# EAGLE design BB (EAGLE 6.5.0)
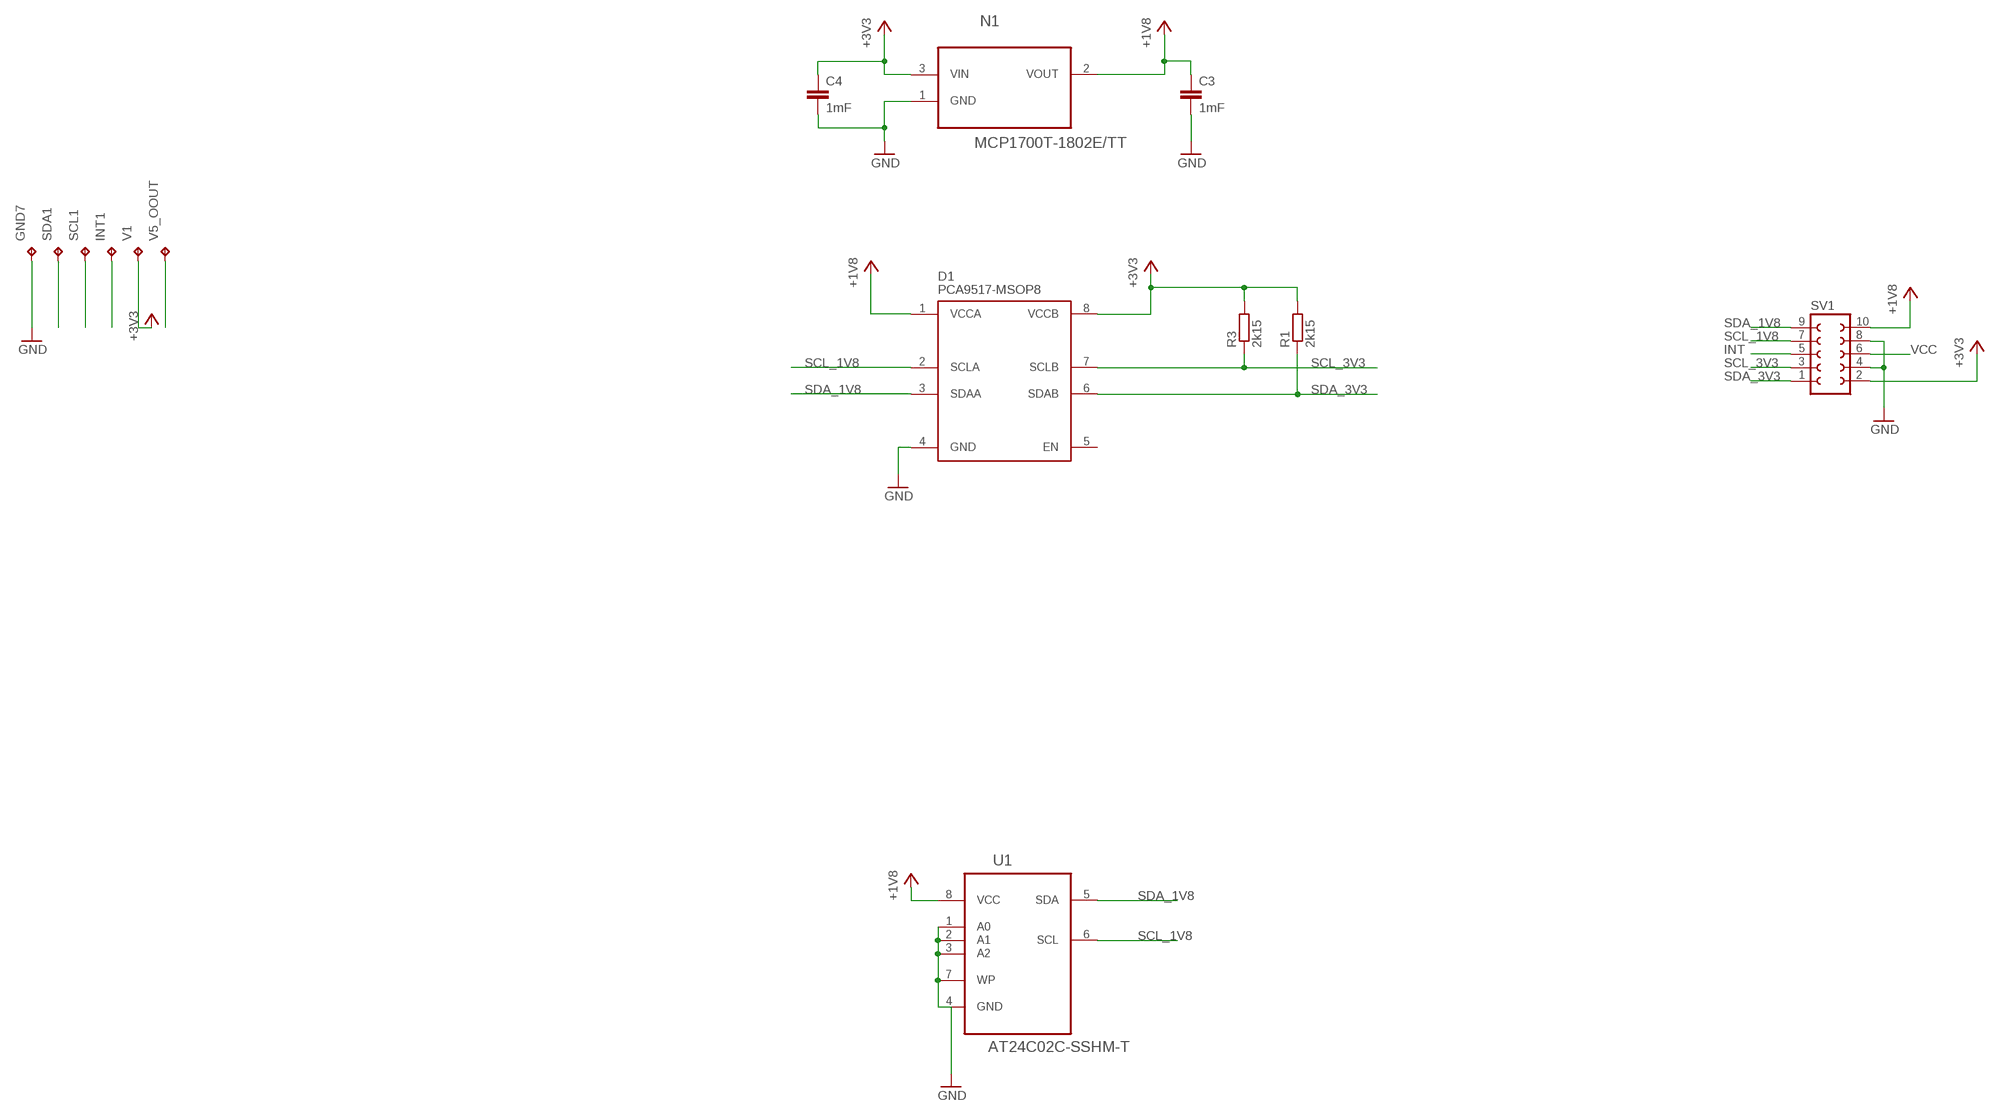
[diagram p0: schematic, sheet 1]

## Parts
C3  1mF  C-EUC1206  [C1206]
C4  1mF  C-EUC1206  [C1206]
D1  PCA9517-MSOP8  PCA9517  [SOP65P490X110-8N]
GND7  TPTP20SQ  [TP20SQ]
INT1  TPTP20SQ  [TP20SQ]
N1  MCP1700T-1802E/TT  [SOT95P237X112-3N]
R1  2k15  R-EU_R1206  [R1206]
R3  2k15  R-EU_R1206  [R1206]
SCL1  TPTP20SQ  [TP20SQ]
SDA1  TPTP20SQ  [TP20SQ]
SV1  FE05-2  [FE05-2]
U1  AT24C02C-SSHM-T  [SOIC127P600X175-8N]
V1  TPTP20SQ  [TP20SQ]
V5_OOUT  TPTP20SQ  [TP20SQ]

## Nets
+1V8: C3.1 D1.1(VCCA) N1.2(VOUT) SV1.10 U1.8(VCC)
+3V3: C4.1 D1.8(VCCB) N1.3(VIN) R1.2 R3.2 SV1.2 V1.TP
GND: C3.2 C4.2 D1.4(GND) GND7.TP N1.1(GND) SV1.4 SV1.8 U1.1(A0) U1.2(A1) U1.3(A2) U1.7(WP)
INT: INT1.TP SV1.5
SCL_1V8: D1.2(SCLA) SCL1.TP SV1.7 U1.6(SCL)
SCL_3V3: D1.7(SCLB) R3.1 SV1.3
SDA_1V8: D1.3(SDAA) SDA1.TP SV1.9 U1.5(SDA)
SDA_3V3: D1.6(SDAB) R1.1 SV1.1
VCC: SV1.6 V5_OOUT.TP
Unconnected: D1.5(EN)

## Power pins joined to a net without a drawn wire
GND: U1.4(GND)

## Library data of the parts
C3 C4 = rcl:C-EU: CAPACITOR, European symbol
D1 = OMAT_IC:PCA9517
GND7 INT1 SCL1 SDA1 V1 V5_OOUT = testpad:TP: Test pad
N1 = Microchip_By_element14_Batch_1:MCP1700T-1802E/TT: Low Quiescent Current LDO; MPN: MCP1700T-1802E/TT; OC_FARNELL: 1296591; OC_NEWARK: 84R5175; PACKAGE: SOT23-3; SUPPLIER: Microchip
R1 R3 = rcl:R-EU_: RESISTOR, European symbol
SV1 = con-lsta:FE05-2: FEMALE HEADER; OC_FARNELL: unknown; OC_NEWARK: unknown
U1 = AT24C02C:AT24C02C-SSHM-T: SERIAL EEPROM IC Memory Size:2Kbit,8-SOIC; MPN: AT24C02C-SSHM-T; OC_FARNELL: 2345577; OC_NEWARK: 68T4067; PACKAGE: 8SOIC; SUPPLIER: ATMEL

## Board
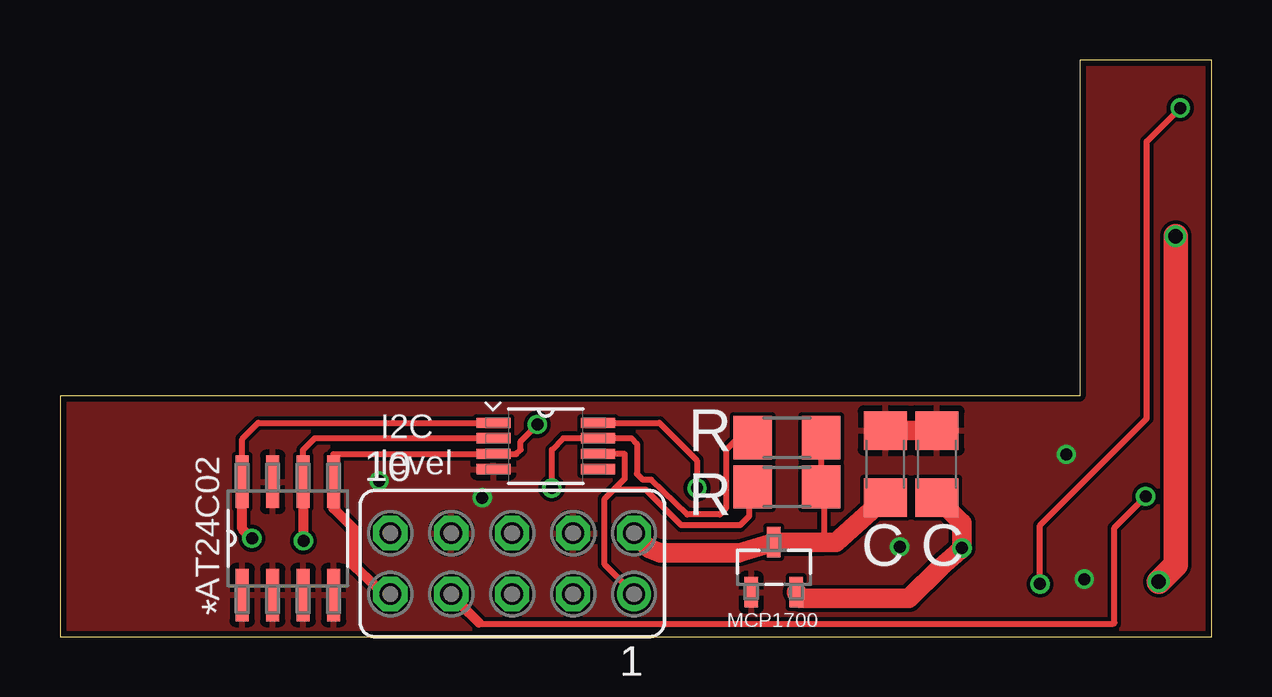
[diagram p1: board, top side]
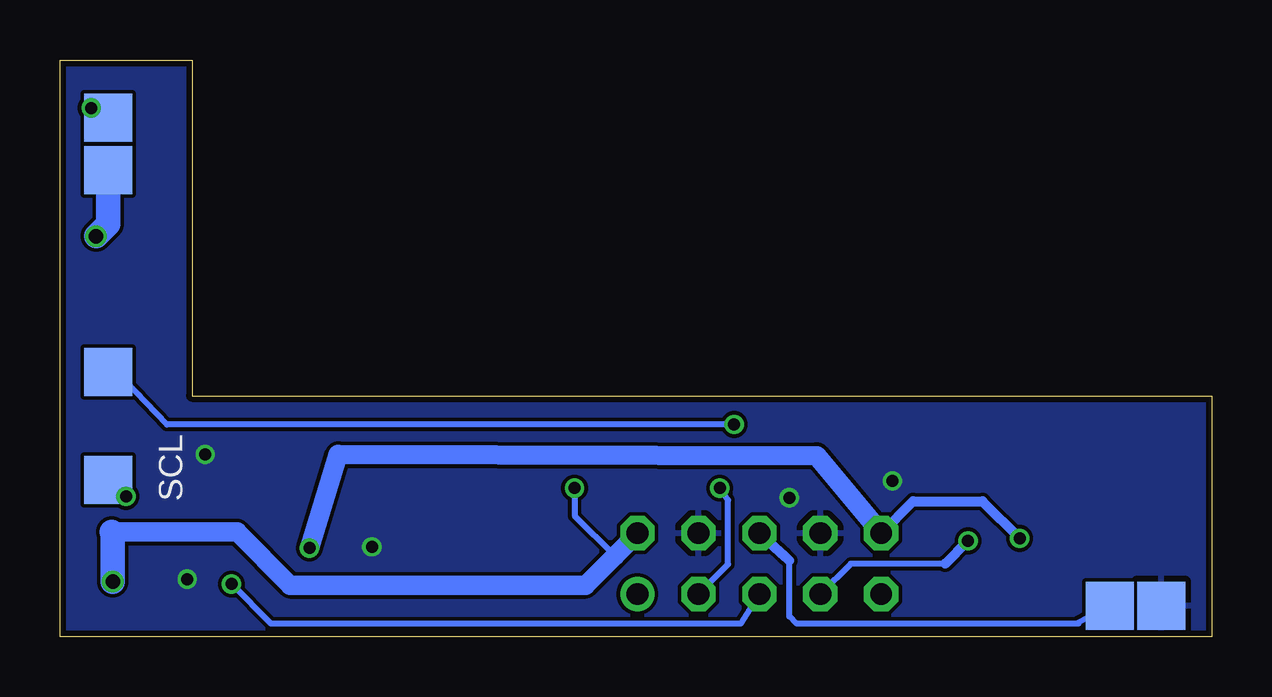
[diagram p2: board, bottom side, seen from below]

Size 48 x 24.05 mm. Coordinates in mm from the lower left corner, seen from the top.
Outline: 0,0 48,0 48,24.05 42.5,24.05 42.5,10.05 0,10.05 0,0
Copper layers (1*16): Top 0.035mm / dielectric 1.5mm / Bottom 0.035mm
Design rules "ITEADstudio_DRC": minimum track width 6mil, minimum drill 12mil, track to track 6mil, track to pad 6mil, pad to pad 6mil, via to via 6mil, smd to smd 0mil, copper to edge 10mil, drill to drill 10mil, minimum pad ring 10mil, minimum via ring 6mil, stop-mask expansion 2mil, vias tented up to drill 100mil, thermal gap 10mil

### Footprints (pad centres in the part's own frame; a part is rotated, then mirrored left to right if it is on the bottom)
C1206 = smd 1.6 x 1.8: 1 -1.4,0; 2 1.4,0
SOP65P490X110-8N = smd 1.422 x 0.432: 1 -2.184,0.965; 2 -2.184,0.33; 3 -2.184,-0.33; 4 -2.184,-0.965; 5 2.184,-0.965; 6 2.184,-0.33; 7 2.184,0.33; 8 2.184,0.965
TP20SQ = smd 2 x 2: TP 0,0
SOT95P237X112-3N = smd 0.559 x 1.27: 1 -0.94,-1.041; 2 0.94,-1.041; 3 0,1.041
R1206 = smd 1.6 x 1.803: 1 -1.422,0; 2 1.422,0
FE05-2 = drill 0.914: 1 -5.08,1.27 | drill 0.914 octagon: 2 -5.08,-1.27; 3 -2.54,1.27; 4 -2.54,-1.27; 5 0,1.27; 6 0,-1.27; 7 2.54,1.27; 8 2.54,-1.27; 9 5.08,1.27; 10 5.08,-1.27
SOIC127P600X175-8N = smd 2.184 x 0.559: 1 -2.362,1.905; 2 -2.362,0.635; 3 -2.362,-0.635; 4 -2.362,-1.905; 5 2.362,-1.905; 6 2.362,-0.635; 7 2.362,0.635; 8 2.362,1.905

### Placement (x,y rotation side)
C3  36.55,7.2 90 top
C4  34.4,7.2 90 top
D1  20.25,7.95 0 top
GND7  2.1,1.3 0 bottom
INT1  46,21.65 0 bottom
N1  29.75,2.9 0 top
R1  30.3,6.25 0 top
R3  30.3,8.3 0 top
SCL1  46,6.55 0 bottom
SDA1  46,11.05 0 bottom
SV1  18.85,3.05 180 top
U1  9.5,4.1 90 top
V1  46,19.45 0 bottom
V5_OOUT  4.25,1.3 0 bottom

### Tracks (layer width: path | path; a pad name or v marks a point on that pad's centre or on a via)
+1V8  (via drill 0.5)
  Top 0.254: U1.8 7.59,8.24 8.27,8.91 D1.1
  Top 0.406: v8,4.1 7.59,4.5 U1.8
  Top 0.813: N1.2 30.86,1.59 35.39,1.59 36.7,2.9 37.5,3.6 v37.6,3.7 37.6,4.75 C3.1
  Bottom 0.406: SV1.10 12.44,5.65 9.55,5.65 v8,4.1
  Bottom 0.813: v37.6,3.7 36.4,7.6 16.45,7.55 SV1.10
+3V3  (via drill 0.5, 0.6)
  Top 0.254: 31.85,3.93 31.85,6.12 R1.2 R3.2 | D1.8 24.98,8.91 26.55,7.35 v26.55,6.2
  Top 0.813: SV1.2 24.55,3.69 25,3.5 28.3,3.5 N1.3 31.85,3.93 31.8,3.93 32.34,3.93 C4.1
  Top 1.016: v46.5,16.7 46.5,3 v45.8,2.3
  Bottom 0.254: v26.55,6.2 26.55,5.05 24.88,3.37
  Bottom 0.813: 45.85,4.37 40.62,4.37 38.4,2.15 26.1,2.15 24.88,3.37 SV1.2
  Bottom 1.016: V1.TP 46,17.2 v46.5,16.7 | v45.8,2.3 45.8,4.32 45.85,4.37
GND  (via drill 0.5)
  Top 0.813: C4.2 C3.2
  other vias: 41.95,7.6 17.6,5.8 13.3,6.5 35,3.75 42.7,2.4
  pour Bottom: 0,10.62 41.7,21.95 41.7,24.12 48,24.12 48,0 0,0
  pour Top: 40.3,10.22 42.5,10.12 42,24.05 48,24.12 48,-0.45 arc-3 0,-0.95 0,10.15
INT  (via drill 0.5)
  Top 0.254: v40.85,2.2 40.85,4.65 45.3,9.1 45.3,20.65 v46.7,22.05
  Bottom 0.254: SV1.5 19.63,0.55 39.2,0.55 v40.85,2.2 | v46.7,22.05 45.3,22.05
  Bottom 0.406: INT1.TP 45.3,22.1 45.3,22.05
SCL_1V8  (via drill 0.5)
  Top 0.254: U1.6 10.13,7.78 10.63,8.28 D1.2 | 17.45,0.6 17.5,0.55 43.9,0.55 arc90 43.95,0.6 43.95,4.55 v45.25,5.85
  Top 0.406: v10.15,4 10.15,6.44 U1.6 | SV1.7 17.06,0.99 17.45,0.6
  Bottom 0.254: 11.1,3.05 15.04,3.05 SV1.7
  Bottom 0.406: v45.25,5.85 45.25,7.26 46,7.26 SCL1.TP | 11.1,3.05 v10.15,4
SCL_3V3  (via drill 0.5)
  Top 0.254: v20.5,6.2 20.5,7.8 20.98,8.28 D1.7 23.82,8.28 24.05,8.05 24.05,6.8 24.3,6.55 24.65,6.55 26.15,5.1 27.5,5.1 27.75,5.35 27.75,7.8 28.25,8.3 R3.1 28.86,8.28
  Bottom 0.254: SV1.3 20.15,3.02 20.15,5.7 v20.5,6.2
SDA_1V8  (via drill 0.5)
  Top 0.254: U1.5 11.4,7.62 D1.3 19.02,7.62 19.2,7.8 19.2,8.15 v19.9,8.85
  Top 0.406: SV1.9 13.47,1.83 12.25,2.95 12.25,4.5 11.4,5.35 U1.5
  Bottom 0.254: v19.9,8.85 43.55,8.85 45.7,11.1
  Bottom 0.813: SDA1.TP 45.7,11.1
SDA_3V3
  Top 0.254: D1.6 23.55,7.62 23.55,6.6 23.07,6.12 | SV1.1 22.7,3.01 22.7,5.75 23.07,6.12 | R1.1 28.73,6.4 28.73,5.02 28.35,4.65 25.9,4.65 24.43,6.12 23.07,6.12
VCC
  Bottom 0.254: 17.79,3.34 17.6,3.15 17.6,0.85 17.3,0.55 5.55,0.55 5.55,0.6 V5_OOUT.TP
  Bottom 0.406: 17.6,3.17 17.79,3.34 SV1.6

### Text on the board
tNames: R / R | I2C / level | C C | AT24C02 | MCP1700
bNames: SCL